# Altium schematic sheet Controller.SchDoc: Controller
size A3; SheetNumber: 2; SheetTotal: 3
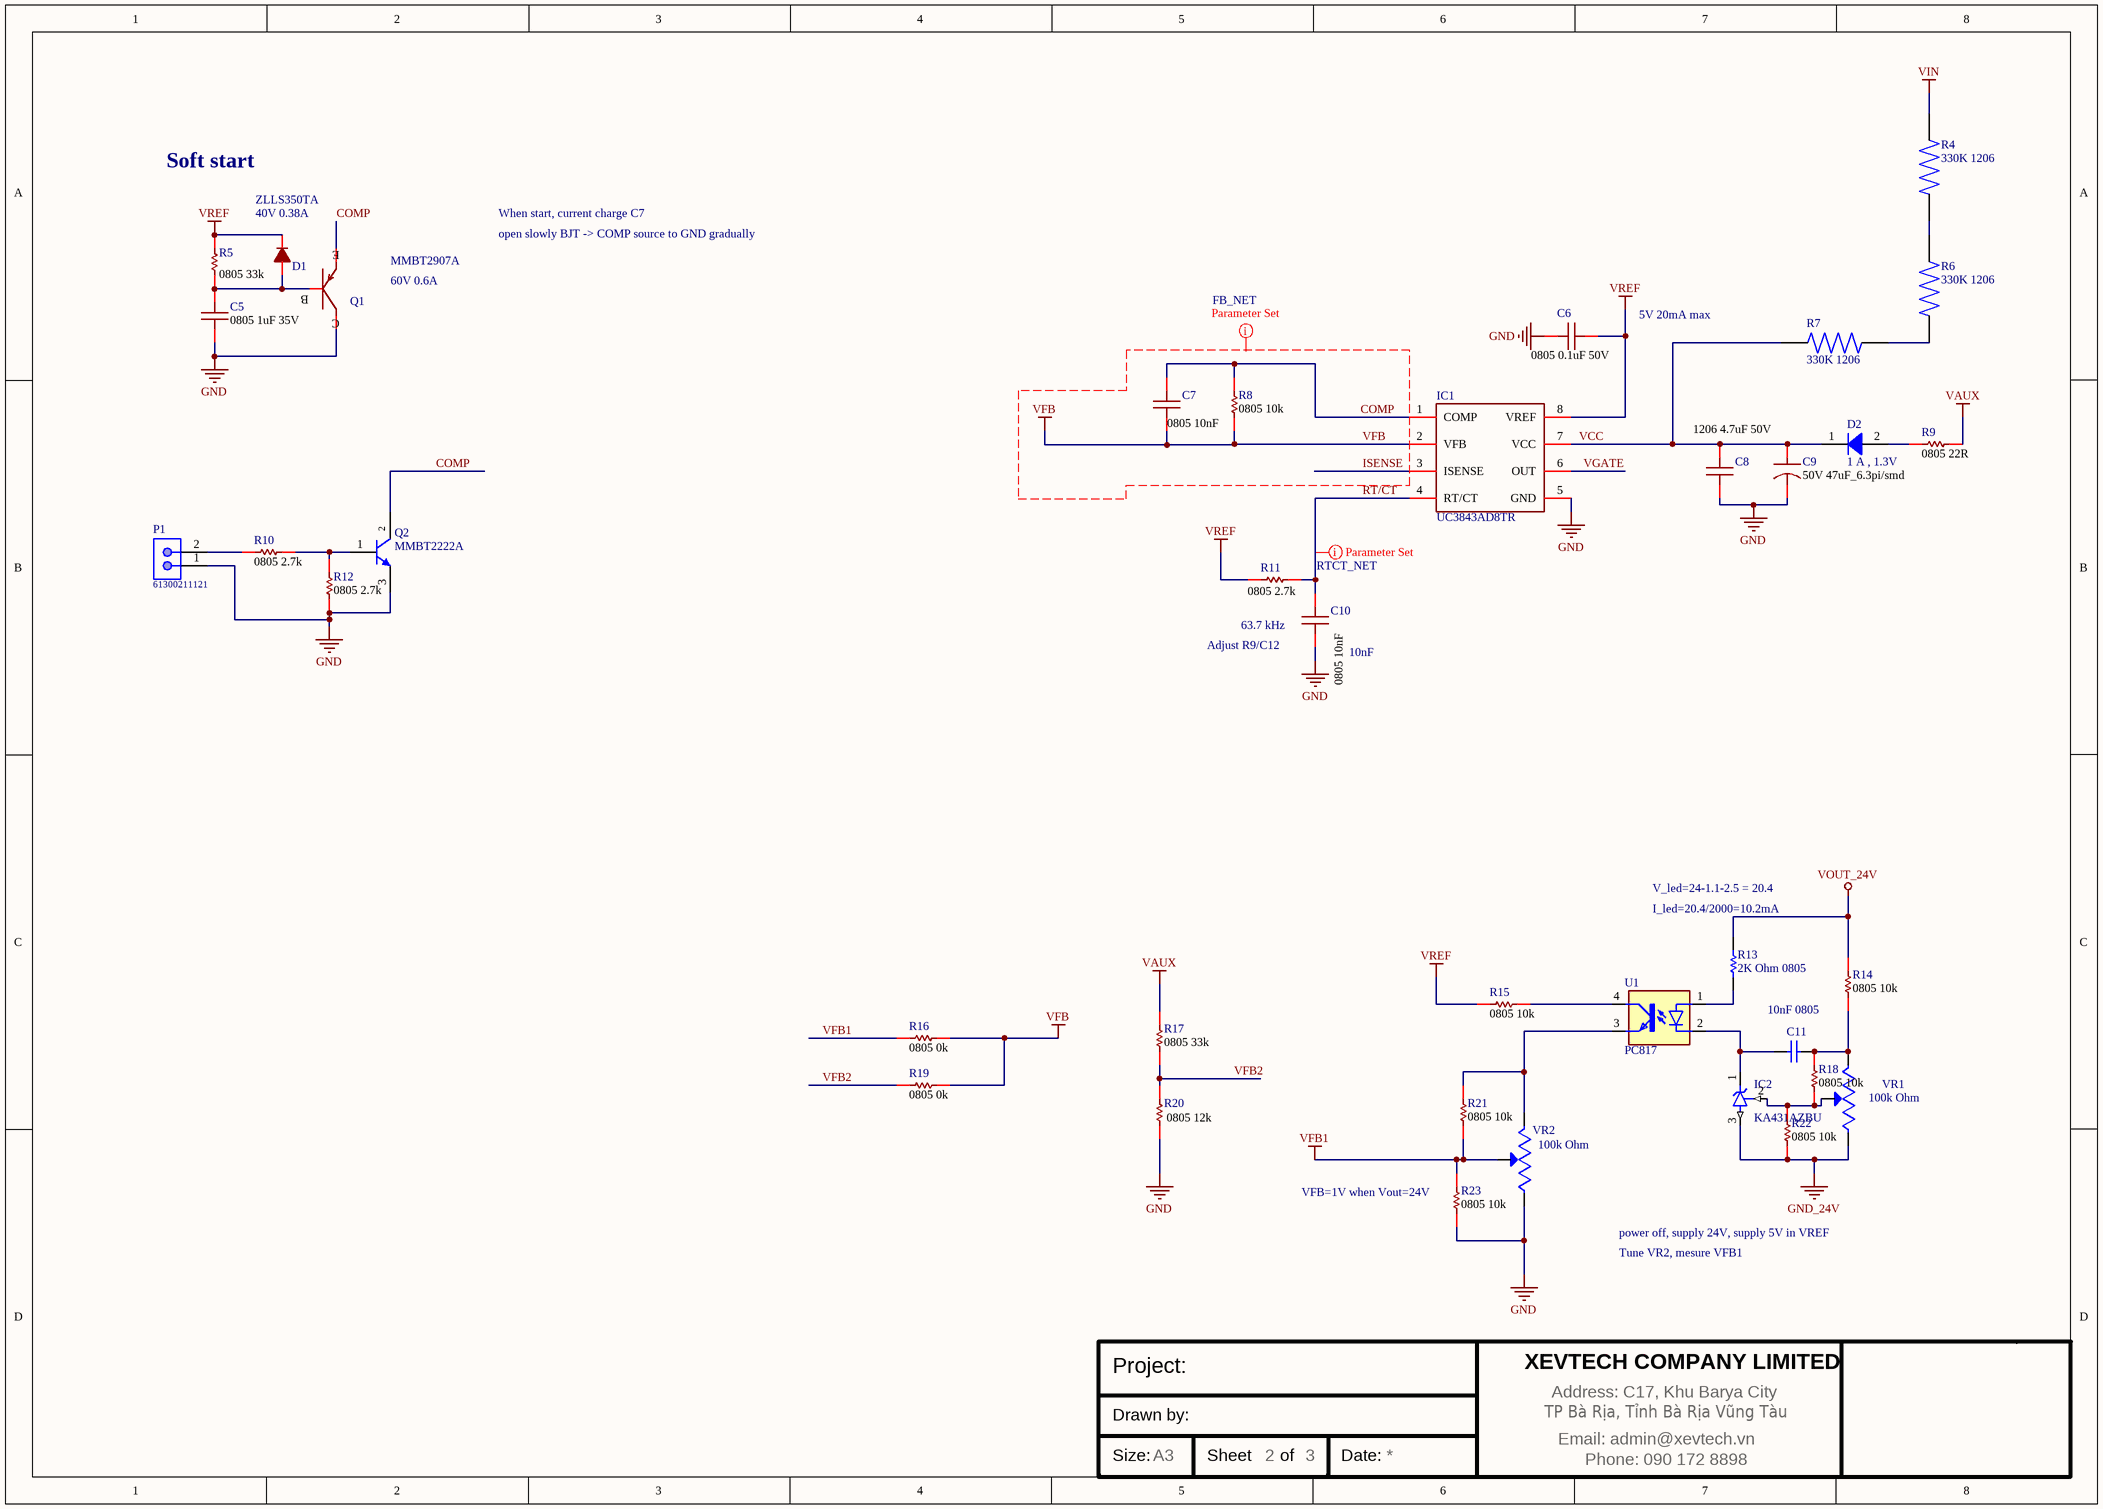
[diagram p0: Controller.SchDoc]

## Parts
C5  value 0805 1uF 35V  [CAP 0805]  (hidden comment: GRM219R7YA105KA12D)
C6  value 0805 0.1uF 50V  [CAP 0805]  (hidden comment: CL21B104KBCNNNC)
C7  value 0805 10nF  [CAP 0805]  (hidden comment: GRM2195C1H103JA01D)
C8  value 1206 4.7uF 50V  [Cap 1206]  (hidden comment: C3216X7R1H475M160AC)
C9  value 50V 47uF_6.3pi/smd  [C-50-47uf_alu]  (hidden comment: EEE-FK1H470XL)
C10  value 0805 10nF  [CAP 0805]  (hidden comment: GCM216R71H102KA37D)
C11  10nF 0805  [CAP_0805]
D1  PMEG3010EB,115  [SOD 523]  (value not drawn)
D2  1 A , 1.3V  [SMA (DO-214AC)]
IC1  UC3843AD8TR  [UC3843_SOIC8]
IC2  KA431AZBU  [SOT23-3]
P1  61300211121  [61300211121]
Q1  MMBT2907A  [SOT 23 3]
Q2  MMBT2222A  [MMBT-SOT23]
R4  330K 1206  [RESC3116X65N]
R5  value 0805 33k  [RES 0805]  (hidden comment: RC0805FR-0733KL)
R6  330K 1206  [RESC3116X65N]
R7  330K 1206  [RESC3116X65N]
R8  value 0805 10k  [RES 0805]  (hidden comment: RC0805FR-1310KL)
R9  value 0805 22R  [RES 0805]  (hidden comment: RC0805FR-0722RP)
R10  value 0805 2.7k  [Res 0805]  (hidden comment: RC0805FR-1312KL)
R11  value 0805 2.7k  [Res 0805]  (hidden comment: RC0805FR-1312KL)
R12  value 0805 2.7k  [Res 0805]  (hidden comment: RC0805FR-1312KL)
R13  2K Ohm 0805  [RESISTOR_0805]
R14  value 0805 10k  [Res 0805]  (hidden comment: RK73B2ATTD104J)
R15  value 0805 10k  [Res 0805]  (hidden comment: RK73B2ATTD104J)
R16  value 0805 0k  [RES 0805]  (hidden comment: RC0805FR-1310KL)
R17  value 0805 33k  [RES 0805]  (hidden comment: RC0805FR-1310KL)
R18  value 0805 10k  [Res 0805]  (hidden comment: RK73B2ATTD104J)
R19  value 0805 0k  [RES 0805]  (hidden comment: RC0805FR-1310KL)
R20  value 0805 12k  [RES 0805]  (hidden comment: RC0805FR-1310KL)
R21  value 0805 10k  [Res 0805]  (hidden comment: RK73B2ATTD104J)
R22  value 0805 10k  [Res 0805]  (hidden comment: RK73B2ATTD104J)
R23  value 0805 10k  [Res 0805]  (hidden comment: RK73B2ATTD104J)
U1  PC817  [PC817]
VR1  3296W-1-250  [TRIM_3296W-1-250]  (value not drawn)
VR2  3296W-1-250  [TRIM_3296W-1-250]  (value not drawn)

## Nets
GND: C5.2 C6.1 C8.2 C9.2 C10.2 IC1.5(GND) P1.1 Q1.C Q2.3(E) R12.2 R20.1 R23.2 VR2.1(CCW)
GND_24V: IC2.3(A) R22.2 VR1.1(CCW)
VAUX: R9.1 R17.2
VFB: C7.2 IC1.2(VFB) R8.1 R16.1 R19.1
VFB1: R16.2 R21.2 R23.1 VR2.2(WIPER)
VIN: R4.2
VOUT_24V: R13.2 R14.2
VREF: C6.2 D1.K IC1.8(VREF) R5.1 R11.2 R15.2
COMP: C7.1 IC1.1(COMP) Q1.E Q2.2(C) R8.2
ISENSE: IC1.3(ISENSE)
RT/CT: C10.1 IC1.4(RT/CT) R11.1
VCC: C8.1 C9.1 D2.1(K) IC1.7(VCC) R7.2
VFB2: R17.1 R19.2 R20.2
VGATE: IC1.6(OUT)
NetC5_1: C5.1 D1.A Q1.B R5.2
NetC11_1: C11.1 R14.1 R18.1 VR1.3(CW)
NetC11_2: C11.2 IC2.1(C) U1.2(C)
NetD2_2: D2.2(A) R9.2
NetIC2_2: IC2.2(REF) R18.2 R22.1 VR1.2(WIPER)
NetP1_2: P1.2 R10.1
NetQ2_1: Q2.1(B) R10.2 R12.1
NetR4_1: R4.1 R6.2
NetR6_1: R6.1 R7.1
NetR13_1: R13.1 U1.1(A)
NetR15_1: R15.1 U1.4(COL)
NetR21_1: R21.1 U1.3(EMIT) VR2.3(CW)

## Layout directives
net class FB_NET: COMP, ISENSE, VFB
net class RTCT_NET: RT/CT

## Notes on the sheet
- Soft start
- ZLLS350TA
- 40V 0.38A
- When start, current charge C7
- open slowly BJT -> COMP source to GND gradually
- 60V 0.6A
- 5V 20mA max
- (near C10) Adjust R9/C12
- 63.7 kHz
- (near C10) 10nF
- V_led=24-1.1-2.5 = 20.4
- (near R13) I_led=20.4/2000=10.2mA
- (near VR1) 100k Ohm
- (near VR2) 100k Ohm
- (near R23) VFB=1V when Vout=24V
- power off, supply 24V, supply 5V in VREF
- Tune VR2, mesure VFB1
- Project:
- XEVTECH COMPANY LIMITED
- Address: C17, Khu Barya City
- Drawn by:
- Size:
- A3
- Sheet
- of
- Date:
- TP Bà Rịa, Tỉnh Bà Rịa Vũng Tàu
- Email: admin@xevtech.vn
- Phone: 090 172 8898

## Library data of the parts
C5 = Cap 0805 1uF: 1 µF ±10% 35V Ceramic Capacitor X7R 0805 (2012 Metric); Supplier 1: Digi-Key; Supplier Part Number 1: 490-10494-1-ND
C6 = Cap 0805 0.1uF: 0.1 µF ±10% 50V Ceramic Capacitor X7R 0805 (2012 Metric); Manufacturer 1: Samsung; Description 1: Multilayer Ceramic Capacitor, 0.1 uF, 50 V, ± 10%, X7R, 0805 [2012 Metric]; Category 1: Ceramic Capacitors; Supplier 1: Digi-Key; Supplier Part Number 1: 1276-1003-1-ND; Manufacturer Part Number 1: CL21B104KBCNNNC; RoHS 1: Yes; Stock 1: 559254; Pricing 1: 1=0,1, 10=0,044, 50=0,024, 100=0,0196, 500=0,01404, 1000=0,01103 (USD); ComponentLink1URL: https://datasheet.ciiva.com/25710/cl21b104kbcnnnc-25710182.pdf?src-supplier=Digi-Key; ComponentLink1Description: https://datasheet.ciiva.com/25710/cl21b104kbcnnnc-25710182.pdf?src-supplier=Digi-Key; ComponentLink2URL: https://datasheet.ciiva.com/29199/454152-da-01-en-vs-kondensator-0805-29199814.pdf?src-supplier=Conrad; ComponentLink2Description: https://datasheet.ciiva.com/29199/454152-da-01-en-vs-kondensator-0805-29199814.pdf?src-supplier=Conrad
C7 = Cap 0805 10nF: 10000 pF ±5% 50V Ceramic Capacitor C0G, NP0 0805 (2012 Metric); Manufacturer 1: Murata; Manufacturer Part Number 1: GRM21BR61H106KE43L; Description 1: Capacitor Ceramic Multilayer; Category 1: Ceramic Capacitors; Supplier 1: Digikey; Supplier Part Number 1: 490-1642-1-ND; RoHS 1: Yes; Stock 1: 19692; Pricing 1: 1=0,3, 10=0,209, 50=0,139, 100=0,1182, 500=0,08342, 1000=0,073 (USD); ComponentLink1URL: https://datasheet.octopart.com/GRM21BR61H106KE43L-Murata-datasheet-155345082.pdf?src-supplier=Element14; ComponentLink1Description: https://datasheet.octopart.com/GRM21BR61H106KE43L-Murata-datasheet-155345082.pdf?src-supplier=Element14; ComponentLink2URL: https://search.murata.co.jp/Ceramy/image/img/A01X/G101/ENG/GRM21BR61H106KE43-01A.pdf?src-supplier=Digi-Key; ComponentLink2Description: https://search.murata.co.jp/Ceramy/image/img/A01X/G101/ENG/GRM21BR61H106KE43-01A.pdf?src-supplier=Digi-Key; ComponentLink3URL: https://datasheet.octopart.com/GRM21BR61H106KE43L-Murata-datasheet-165579666.pdf?src-supplier=TME; ComponentLink3Description: https://datasheet.octopart.com/GRM21BR61H106KE43L-Murata-datasheet-165579666.pdf?src-supplier=TME
C8 = Cap 1206 4.7uF: 4.7 µF ±20% 50V Ceramic Capacitor X7R 1206 (3216 Metric); Manufacturer 1: TDK; Manufacturer Part Number 1: CGA5L1X7R1V106M160AC; Description 1: Cap Ceramic 10uF 35V X7R 20% SMD 1206 125°C Blister Plastic T/R; Category 1: Ceramic Capacitors; Capacitance: 10uF; Voltage Rating: 35V; RoHS 1: Yes; Stock 1: 4126; Pricing 1: 1=0,72, 10=0,53, 50=0,4242, 100=0,3636, 500=0,28784, 1000=0,2424 (USD); Mount: Surface Mount; Case/Package: 1206; Case Code (Imperial): 1206; Case Code (Metric): 3216; Weight: 0.000571oz; Min Operating Temperature: -55°C; Max Operating Temperature: 125°C; Packaging: Tape and Reel; Tolerance: 20%; Dielectric: X7R; Termination: SMD/SMT; Voltage Rating (DC): 35V; Package Quantity: 2000; Series: CGA; Length: 0.126inch; Width: 1.6mm; Height: 1.6mm; Thickness: 0.071inch; Ratings: AEC-Q200; RoHS Compliant: Yes; ComponentLink1URL: https://product.tdk.com/info/en/catalog/datasheets/mlcc_automotive_general_en.pdf?src-supplier=Digi-Key; ComponentLink1Description: https://product.tdk.com/info/en/catalog/datasheets/mlcc_automotive_general_en.pdf?src-supplier=Digi-Key; ComponentLink2URL: http://product.tdk.com/capacitor/mlcc/detailed_information.php?lang=en&ref=jp&part_no=CGA5L1X7R1V106M160AC&src-supplier=Mouser; ComponentLink2Description: http://product.tdk.com/capacitor/mlcc/detailed_information.php?lang=en&ref=jp&part_no=CGA5L1X7R1V106M160AC&src-supplier=Mouser; ComponentLink3URL: http://product.tdk.com/capacitor/mlcc/class/print_detail_pdf.php?lang=en&part_no=CGA5L1X7R1V106M160AC&src-supplier=Avnet; ComponentLink3Description: http://product.tdk.com/capacitor/mlcc/class/print_detail_pdf.php?lang=en&part_no=CGA5L1X7R1V106M160AC&src-supplier=Avnet; ComponentLink4URL: https://product.tdk.com/info/en/catalog/spec/mlccspec_automotive_general_midvoltage_en.pdf?src-supplier=Digi-Key; ComponentLink4Description: https://product.tdk.com/info/en/catalog/spec/mlccspec_automotive_general_midvoltage_en.pdf?src-supplier=Digi-Key; Supplier 1: Digikey; Supplier Part Number 1: 445-8033-1-ND
C9 = Capacitor-50V 47u_6.3pi: CAP ALUM 47UF 20% 50V SMD; Manufacturer: Panasonic; Supplier Part Number: 10-EEE-FK1H470XLCTND; Package/Case: 6.3mm (dia); Supplier 1: Digi-Key; Supplier Part Number 1: 10-EEE-FK1H470XLCT-ND
C10 = Cap 0805 1nF: 1000 pF 50 VDC 10% 0805 X7R; Manufacturer 1: Murata; Manufacturer Part Number 1: GRM21BR61H106KE43L; Description 1: Capacitor Ceramic Multilayer; Category 1: Ceramic Capacitors; Supplier 1: Digikey; Supplier Part Number 1: 490-6057-1-ND; RoHS 1: Yes; Stock 1: 19692; Pricing 1: 1=0,3, 10=0,209, 50=0,139, 100=0,1182, 500=0,08342, 1000=0,073 (USD); ComponentLink1URL: https://datasheet.octopart.com/GRM21BR61H106KE43L-Murata-datasheet-155345082.pdf?src-supplier=Element14; ComponentLink1Description: https://datasheet.octopart.com/GRM21BR61H106KE43L-Murata-datasheet-155345082.pdf?src-supplier=Element14; ComponentLink2URL: https://search.murata.co.jp/Ceramy/image/img/A01X/G101/ENG/GRM21BR61H106KE43-01A.pdf?src-supplier=Digi-Key; ComponentLink2Description: https://search.murata.co.jp/Ceramy/image/img/A01X/G101/ENG/GRM21BR61H106KE43-01A.pdf?src-supplier=Digi-Key; ComponentLink3URL: https://datasheet.octopart.com/GRM21BR61H106KE43L-Murata-datasheet-165579666.pdf?src-supplier=TME; ComponentLink3Description: https://datasheet.octopart.com/GRM21BR61H106KE43L-Murata-datasheet-165579666.pdf?src-supplier=TME
C11 = 0108058281050: CAP, size 0805, 8.2 uF, 50 VDC; Manufacture Name: TDK; Manufacture SN: CGA4C2C0G1H822J060AA; Capacitance: 8.2 uF; Tolerance: +/-5%; Voltage Rating DC: 50 VDC; ComponentLink2Description: Datasheet; ComponentLink2URL: https://product.tdk.com/system/files/dam/doc/product/capacitor/ceramic/mlcc/catalog/mlcc_automotive_general_en.pdf?ref_disty=mouser; Operating Temperature: -55 to +125degC; Packaging: Tape and Reel; Mounting Technology: SMT; Size: 0805; Supplier 1 Name: Mouser; Supplier 1 SN: 810-CGA4C2C0G1H822J; Supplier 1 URL: https://www.mouser.vn/ProductDetail/TDK/CGA4C2C0G1H822J060AA?qs=FxQuwy19cyAK0jQ6P5l0pQ%3D%3D&utm_source=mouser-refine-download&utm_medium=file&utm_campaign=CGA4C2C0G1H822J060AA&utm_content=TDK; Supplier 2 Name: Digi-Key; Supplier 2 SN: 445-6946-2-ND; Supplier 2 URL: https://www.digikey.com/en/products/detail/tdk-corporation/cga4c2c0g1h822j060aa/2672839; Supplier 3 Name: thegioiic; Supplier 3 SN: OEM; Supplier 3 URL: N/A; Value: 8.2 uF, 50 VDC
D1 = Diode 30V 1A: Diode 30 V 1A Surface Mount SOD-523; Manufacturer 1: Nexperia; Description 1: Rectifier Diode, Schottky, 1 Phase, 1 Element, 1A, Silicon; Category 1: Rectifier Diodes; Max Reverse Leakage Current: 500uA; Max Surge Current: 3A; Max Repetitive Reverse Voltage (Vrrm): 30V; Peak Non-Repetitive Surge Current: 5A; Element Configuration: 5460ElementConfiguration; Forward Voltage: 680mV; Supplier 1: Digikey; Supplier Part Number 1: 1727-5834-1-ND; ComponentLink1URL: https://datasheet.octopart.com/BZX585-C9V1%2C135-Nexperia-datasheet-81456219.pdf?src-supplier=Future+Electronics; ComponentLink1Description: https://datasheet.octopart.com/BZX585-C9V1%2C135-Nexperia-datasheet-81456219.pdf?src-supplier=Future+Electronics; Manufacturer Part Number 1: PMEG3010EB,115; RoHS 1: Yes; Stock 1: 7761; Pricing 1: 1=0,46, 10=0,326, 100=0,1644, 500=0,14572, 1000=0,11341, 3000=0,1015, 6000=0,09923, 9000=0,08789, 30000=0,08676, 75000=0,07371 (USD); Mount: 8Mount; Number of Pins: 2NUMBER; Min Operating Temperature: -65°C; Max Operating Temperature: 150°C; Forward Current: 1A; Max Reverse Voltage (DC): 30V; Max Reverse Current: 500uA; Average Rectified Current: 1A; Max Forward Surge Current (Ifsm): 5A; Radiation Hardening: 5898YesNo; RoHS Compliant: Yes; Lead Free: 5697LeadFree; Reach SVHC Compliant: 4186SVHC; ComponentLink2URL: https://assets.nexperia.com/documents/packing/SOD523_115.pdf?src-supplier=Digikey; ComponentLink2Description: https://assets.nexperia.com/documents/packing/SOD523_115.pdf?src-supplier=Digikey; ComponentLink3URL: https://datasheet.octopart.com/PMEG3010EB%2C115-Nexperia-datasheet-12552804.pdf?src-supplier=Farnell; ComponentLink3Description: https://datasheet.octopart.com/PMEG3010EB%2C115-Nexperia-datasheet-12552804.pdf?src-supplier=Farnell
D2 = RS1M: Rectifiers 1000V 1a Fast Rect SMa; Manufacturer: onsemi; Max Surge Current: 30 A; Peak Reverse Voltage: 1 kV; Power Dissipation: 1.19 W; Recovery Time: 500 ns; Reverse Current: 5 uA; Type: Rectifiers; Supplier 1 URL: https://www.mouser.vn/ProductDetail/onsemi-Fairchild/RS1M?qs=e%2FRqmsgwm9icSRWI%2F467wA%3D%3D; Supplier 2 URL: https://www.digikey.com/en/products/detail/onsemi/rs1m/1048919; Supplier 3 URL: https://www.thegioiic.com/fr107-rs1m-sma-diode-chinh-luu-1a-1kv; Value: 1 A , 1.3V; Forward Current: 1 A; Forward Voltage: 1.3 V; Maximum Diode Capacitance: N/A; Manufacturer Part Number: RS1M; Supplier 1: Mouser; Supplier 1 Part Number: 512-RS1M; Supplier 2: Digi-Key; Supplier 2 Part Number: RS1MFSTR-ND; Supplier 3: thegioiic; Supplier 3 Part Number: FR107 RS1M; Mount: SMD/SMT; Operating Temperature Max: + 85 C; Operating Temperature Min: - 40 C; Package / Case: DO-214AC; ComponentLink1Description: Datasheet; ComponentLink1URL: https://www.mouser.vn/datasheet/2/308/1/RS1M_D-2320127.pdf; Packaging: Tape and Reel; LCSC Part #: N/A
IC1 = UC3843AD8TR: UC3843 Switching IC 8.4V 500kHz; Supplier 1: Digikey; Supplier Part Number 1: 296-27152-1-ND
P1 = 61300211121: WR-PHD Pin Header, THT, pitch 2.54mm, Single Row, Vertical, 2p; Manufacturer: Wurth Elektronik; Pin Number: 2; Rated Current: 3A; Working Voltage: 250VAC; Withstanding Voltage: 500VAC; Contact Resistance: 20mOhm; Supply Name 1: Mouser; ComponentLink1Description: Manufacturer; ComponentLink1URL: http://www.we-online.de; ComponentLink2Description: Datasheet; ComponentLink2URL: https://www.we-online.com/catalog/datasheet/61300211121.pdf; Manufacturer Part Number: 61300211121; Published Date: May 2020; Pitch: 2.54mm; Operating Temperature: -40 to +105degC; Mounting Technology: THT; Packaging: Bag; Gender: Pin Header; Row Number: Single; Orientation: Vertical; ComponentLink3Description: Global Supply; ComponentLink3URL: https://www.mouser.vn/ProductDetail/Wurth-Elektronik/61300211121?qs=t4813l51qx%252B1A5GYDQxPlw%3D%3D; Supplier 1 Name: Mouser; Supplier 1 SN: 710-61300211121; Supplier 1 URL: https://www.mouser.vn/ProductDetail/Wurth-Elektronik/61300211121?qs=t4813l51qx%252B1A5GYDQxPlw%3D%3D; Supplier 2 Name: Digi-Key; Supplier 2 SN: N/A; Supplier 2 URL: N/A; Supplier 3 Name: thegioiic; Supplier 3 SN: N/A; Supplier 3 URL: N/A
Q1 = BJT PNP 40V: Trans GP BJT PNP 40V 0.2A 300mW Automotive 3-Pin SOT-23 T/R; Manufacturer 1: ON Semiconductor; Manufacturer Part Number 1: SMMBT3906LT1G; Category 1: BJTs; Supplier 1: Digikey; Supplier Part Number 1: SMMBT3906LT1GOSCT-ND; RoHS 1: Yes; Description 1: Trans GP BJT PNP 40V 0.2A 300mW Automotive 3-Pin SOT-23 T/R; Stock 1: 92580; Pricing 1: 1=0,17, 10=0,124, 100=0,0667, 500=0,05236, 1000=0,03636, 3000=0,03012, 6000=0,02848, 9000=0,02424, 30000=0,02242, 75000=0,01939, 150000=0,01612 (USD); Lead Free: 5697LeadFree; ComponentLink1URL: https://datasheet.ciiva.com/980/mmbt3906lt1-d-980808.pdf?src-supplier=Digikey; ComponentLink1Description: https://datasheet.ciiva.com/980/mmbt3906lt1-d-980808.pdf?src-supplier=Digikey; ComponentLink2URL: https://datasheet.ciiva.com/16285/mmbt3906lt1-d-16285303.pdf?src-supplier=Mouser; ComponentLink2Description: https://datasheet.ciiva.com/16285/mmbt3906lt1-d-16285303.pdf?src-supplier=Mouser; ComponentLink3URL: https://datasheet.ciiva.com/11204/mmbt3906lt1-d-11204922.pdf?src-supplier=Avnet; ComponentLink3Description: https://datasheet.ciiva.com/11204/mmbt3906lt1-d-11204922.pdf?src-supplier=Avnet
Q2 = MMBT2222A: TRANS NPN, 40V, 600MA, SOT23-3; DC Current Gain: 35-300; Gain Bandwidth Product fT: 250MHz; Power Dissipation: 250mW; Current - Collector: 600mA; Package: SOT-23; Supplier 1 Name: Mouser; Supplier 1 SN: 637-MMBT2222A; Supplier 1 URL: https://www.mouser.vn/ProductDetail/Diotec-Semiconductor/MMBT2222A?qs=OlC7AqGiEDl9N1c3%252BL%2F%252Brw%3D%3D; Supplier 2 Name: Digi-Key; Supplier 2 SN: 2796-MMBT2222ATR-ND; Supplier 2 URL: https://www.digikey.com/en/products/detail/diotec-semiconductor/MMBT2222A/13163394; Supplier 3 Name: thegioiic; Supplier 3 URL: https://www.thegioiic.com/mmbt2222a-transistor-npn-40v-0-6a-3-chan-sot-23; Transistor Type: NPN; Voltage - Collector Emitter Breakdown: 40V; Supplier 3 SN: N/A; Value: MMBT2222A
R4 R6 R7 = RC1206JR-0713RL: 13 Ohms Â±5% 0.25W, 1/4W Chip Resistor 1206 (3216 Metric) Moisture Resistant Thick Film; MF: Yageo; Check_prices: https://www.snapeda.com/parts/RC1206JR-0713RL/Yageo/view-part/?ref=eda; Value: *; Availability: In Stock; MP: RC1206JR-0713RL; Price: None; Package: 3116 Yageo; SnapEDA_Link: https://www.snapeda.com/parts/RC1206JR-0713RL/Yageo/view-part/?ref=snap; Purchase-URL: https://pricing.snapeda.com/search/part/RC1206JR-0713RL/?ref=eda
R5 = RES_0805_33k: 33 kOhms ±1% 0.125W, 1/8W Chip Resistor 0805 (2012 Metric) Moisture Resistant Thick Film; Manufacturer 1: Yageo; Manufacturer Part Number 1: AC0805FR-0733RL; Description 1: SMD Chip Resistor, 33 Ohm, ± 1%, 125 mW, 0805 [2012 Metric], Thick Film, General Purpose; Category 1: Chip SMD Resistors; RoHS 1: Yes; Stock 1: 24620; Pricing 1: 1=0,1, 10=0,029, 50=0,0188, 100=0,0158, 500=0,01096, 1000=0,00948 (USD); ComponentLink1URL: http://www.mouser.com/ds/2/447/yageodocoutput-1111992.pdf?src-supplier=Mouser; ComponentLink1Description: http://www.mouser.com/ds/2/447/yageodocoutput-1111992.pdf?src-supplier=Mouser; ComponentLink2URL: http://www.yageo.com/NewPortal/yageodocoutput?fileName=/pdf/R-Chip/PYu-AC_51_RoHS_L_6.pdf&src-supplier=Digi-Key; ComponentLink2Description: http://www.yageo.com/NewPortal/yageodocoutput?fileName=/pdf/R-Chip/PYu-AC_51_RoHS_L_6.pdf&src-supplier=Digi-Key; ComponentLink3URL: https://www.yageo.com/upload/media/product/productsearch/datasheet/rchip/PYu-AC_51_RoHS_L_7.pdf?src-supplier=Digi-Key; ComponentLink3Description: https://www.yageo.com/upload/media/product/productsearch/datasheet/rchip/PYu-AC_51_RoHS_L_7.pdf?src-supplier=Digi-Key; ComponentLink4URL: http://www.yageo.com/NewPortal/yageodocoutput?fileName=/pdf/R-Chip/PYu-AC_51_RoHS_L_5.pdf&src-supplier=Digi-Key; ComponentLink4Description: http://www.yageo.com/NewPortal/yageodocoutput?fileName=/pdf/R-Chip/PYu-AC_51_RoHS_L_5.pdf&src-supplier=Digi-Key; ComponentLink5URL: https://datasheet.octopart.com/AC0805FR-0733RL-Yageo-datasheet-151884373.pdf?src-supplier=Future+Electronics; ComponentLink5Description: https://datasheet.octopart.com/AC0805FR-0733RL-Yageo-datasheet-151884373.pdf?src-supplier=Future+Electronics; Supplier 1: Future Electronics; Supplier Part Number 1: 1593995
R8 R16 R17 R19 R20 = RES_0805_10k: 10 kOhms ±1% 0.125W, 1/8W Chip Resistor 0805 (2012 Metric) Moisture Resistant Thick Film; Supplier 1: Digi-Key; Supplier Part Number 1: 13-RC0805FR-1310KLDKR-ND
R9 = RES_0805_22R: 22 Ohms ±1% 0.125W, 1/8W Chip Resistor 0805 (2012 Metric) Automotive AEC-Q200, Moisture Resistant Thick Film; Manufacturer 1: Yageo; Manufacturer Part Number 1: AC0805FR-0733RL; Description 1: SMD Chip Resistor, 33 Ohm, ± 1%, 125 mW, 0805 [2012 Metric], Thick Film, General Purpose; Category 1: Chip SMD Resistors; Supplier 1: Digikey; RoHS 1: Yes; Stock 1: 24620; Pricing 1: 1=0,1, 10=0,029, 50=0,0188, 100=0,0158, 500=0,01096, 1000=0,00948 (USD); ComponentLink1URL: http://www.mouser.com/ds/2/447/yageodocoutput-1111992.pdf?src-supplier=Mouser; ComponentLink1Description: http://www.mouser.com/ds/2/447/yageodocoutput-1111992.pdf?src-supplier=Mouser; ComponentLink2URL: http://www.yageo.com/NewPortal/yageodocoutput?fileName=/pdf/R-Chip/PYu-AC_51_RoHS_L_6.pdf&src-supplier=Digi-Key; ComponentLink2Description: http://www.yageo.com/NewPortal/yageodocoutput?fileName=/pdf/R-Chip/PYu-AC_51_RoHS_L_6.pdf&src-supplier=Digi-Key; ComponentLink3URL: https://www.yageo.com/upload/media/product/productsearch/datasheet/rchip/PYu-AC_51_RoHS_L_7.pdf?src-supplier=Digi-Key; ComponentLink3Description: https://www.yageo.com/upload/media/product/productsearch/datasheet/rchip/PYu-AC_51_RoHS_L_7.pdf?src-supplier=Digi-Key; ComponentLink4URL: http://www.yageo.com/NewPortal/yageodocoutput?fileName=/pdf/R-Chip/PYu-AC_51_RoHS_L_5.pdf&src-supplier=Digi-Key; ComponentLink4Description: http://www.yageo.com/NewPortal/yageodocoutput?fileName=/pdf/R-Chip/PYu-AC_51_RoHS_L_5.pdf&src-supplier=Digi-Key; ComponentLink5URL: https://datasheet.octopart.com/AC0805FR-0733RL-Yageo-datasheet-151884373.pdf?src-supplier=Future+Electronics; ComponentLink5Description: https://datasheet.octopart.com/AC0805FR-0733RL-Yageo-datasheet-151884373.pdf?src-supplier=Future+Electronics; Supplier Part Number 1: 13-RC0805FR-0722RPCT-ND
R10-R12 = RES_0805_12k: 12 kOhms ±1% 0.125W, 1/8W Chip Resistor 0805 (2012 Metric) Moisture Resistant Thick Film; Supplier 1: Digikey; Supplier Part Number 1: 13-RC0805FR-1312KLCT-ND
R13 = 00080545311: RES, size 0805, 4.53 KOhm, 1/8W; Resistance Tolerance: +/-1%; Resistance: 4.53 KOhm; Size: 0805; Rated Power: 1/8 W; Supplier 1 Name: Mouser; Supplier 1 SN: 652-CR0805FX-4532ELF; Supplier 1 URL: https://www.mouser.vn/ProductDetail/Bourns/CR0805-FX-4532ELF?qs=sGAEpiMZZMtG0KNrPCHnjfC2zYK6Lg3%2F1%2Fel6VE8vT0%3D; Supplier 2 Name: Digi-Key; Supplier 2 SN: 311-45.3KCRDKR-ND; Supplier 2 URL: https://www.digikey.com/en/products/detail/yageo/RC0805FR-0745K3L/727965; Mounting Technology: SMT; Supplier 3 Name: Thegioiic; Supplier 3 SN: N/A; Supplier 3 URL: N/A; Manufacture  Name: N/A; Manufacture  SN: N/A; Value: 4.53 KOhm, 1/8W; ComponentLink1Description: Datasheet link; ComponentLink1URL: N/A; ComponentLink2Description: Supplier 1 URL; ComponentLink2URL: https://www.mouser.vn/ProductDetail/Bourns/CR0805-FX-4532ELF?qs=sGAEpiMZZMtG0KNrPCHnjfC2zYK6Lg3%2F1%2Fel6VE8vT0%3D; ComponentLink3Description: Supplier 2 URL; ComponentLink3URL: https://www.digikey.com/en/products/detail/yageo/RC0805FR-0745K3L/727965; ComponentLink4Description: Supplier 3 URL; ComponentLink4URL: N/A
R14 R15 R18 R21-R23 = RES_0805_100k: 100 kOhms ±1% 0.250W, 1/4W Chip Resistor 0805; Supplier 1: Digikey; Supplier Part Number 1: 2019-RK73B2ATTD104JCT-ND
VR1 VR2 = 3296W-1-250: 25 Ohms 0.5W, 1/2W PC Pins Through Hole Trimmer Potentiometer Cermet 25.0 Turn Top Adjustment; MF: Bourns; Purchase-URL: https://pricing.snapeda.com/search/part/3296W-1-250/?ref=eda; Check_prices: https://www.snapeda.com/parts/3296W-1-250/Bourns/view-part/?ref=eda; SnapEDA_Link: https://www.snapeda.com/parts/3296W-1-250/Bourns/view-part/?ref=snap; Price: None; Availability: In Stock; Package: NON STANDARD-3 Bourns; MP: 3296W-1-250; Value: *